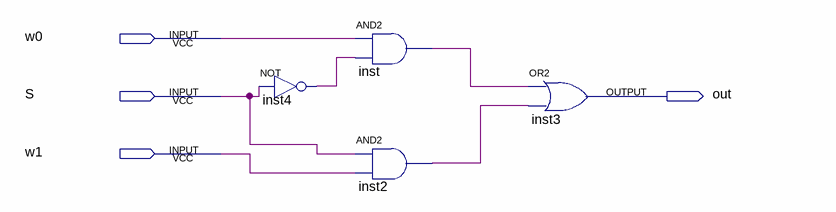
[diagram p0: schematic sheet]
// Quartus schematic 2to1mux.bdf as structural Verilog: 4 symbols, 4 pins
module \2to1mux  (
  input  w0,
  input  S,
  input  w1,
  output out
);

  wire inst2_out, inst4_out, inst_out;

  not inst4 (inst4_out, S);
  and inst (inst_out, w0, inst4_out);
  and inst2 (inst2_out, S, w1);
  or inst3 (out, inst_out, inst2_out);
endmodule
